# EAGLE design Temperature Module (EAGLE 9.1.3)
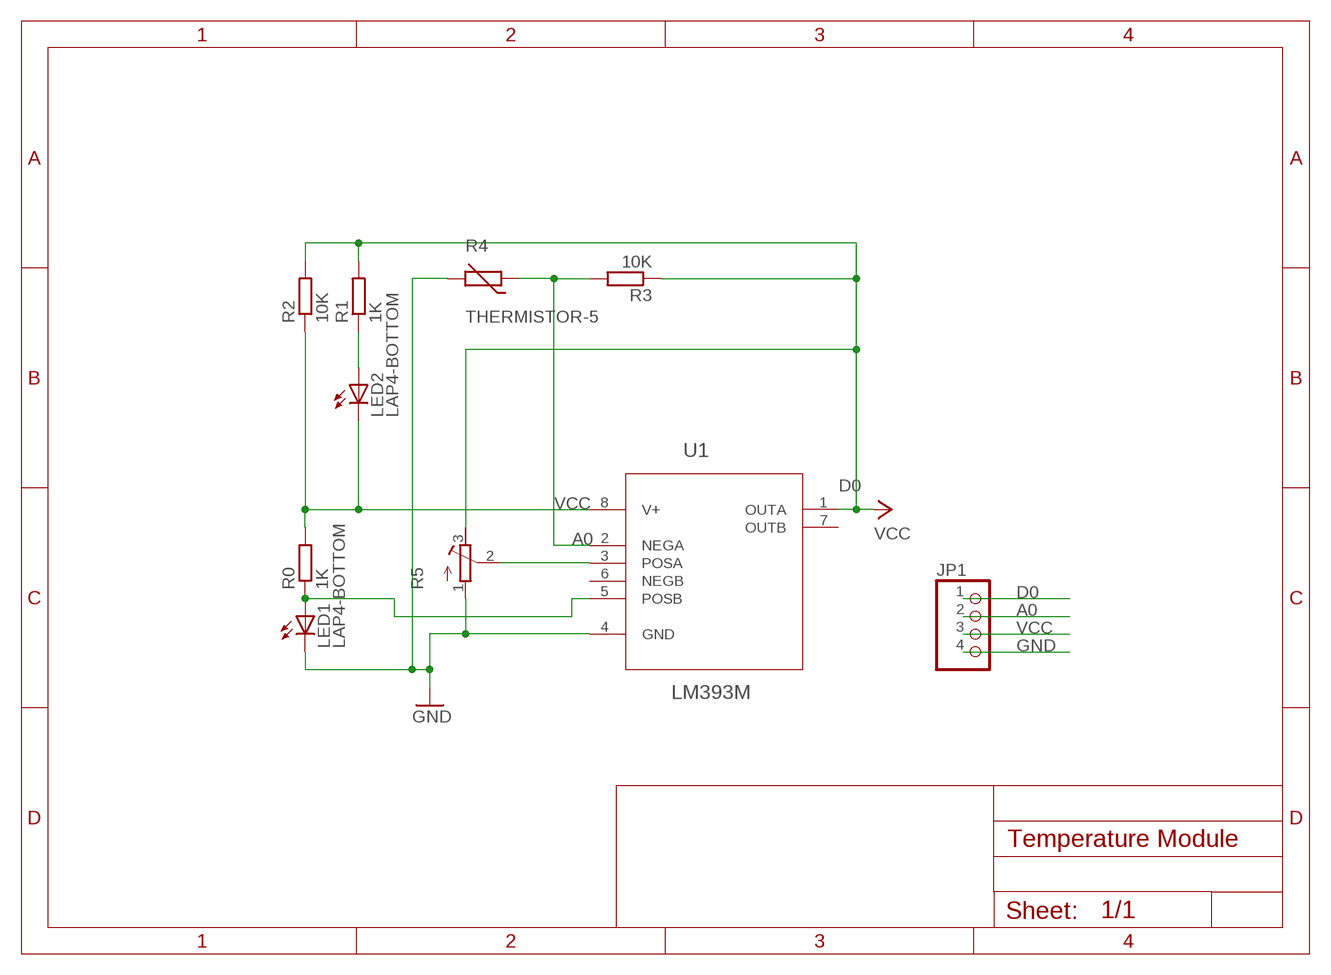
[diagram p0: schematic, sheet 1]

## Parts
JP1  PINHD-1X4  [1X04]
LED1  LAP4-BOTTOM  [P47F-BOTTOM]
LED2  LAP4-BOTTOM  [P47F-BOTTOM]
R0  1K  R-EU_MELF0207R  [MINI_MELF-0207R]
R1  1K  R-EU_MELF0207R  [MINI_MELF-0207R]
R2  10K  R-EU_MELF0207R  [MINI_MELF-0207R]
R3  10K  R-EU_MELF0207R  [MINI_MELF-0207R]
R4  THERMISTOR-5  [R-5]
R5  R-TRIMMCVR42A  [RTRIMCVR42A]
U1  LM393M  [SOIC127P620X175-8N]

## Nets
A0: JP1.2 R3.2 R4.1 U1.2(NEGA)
D0: JP1.1 R1.2 R2.2 R3.1 R5.3(E) U1.1(OUTA) ; supply symbol labelled VCC
GND: JP1.4 LED1.C R4.2 R5.1(A) U1.4(GND)
N$3: R5.2(S) U1.3(POSA)
N$5: LED1.A R0.1 U1.5(POSB)
N$6: LED2.A R1.1
VCC: JP1.3 LED2.C R0.2 R2.1 U1.8(V+)
Unconnected: U1.6(NEGB) U1.7(OUTB)

## Library data of the parts
JP1 = pinhead:PINHD-1X4: PIN HEADER
LED1 LED2 = led:*P4: PointLED® Enhanced Thinfilm LED TOP & BOTTOM mount LS P47F, LR P47F, LA P47F, LY P47F, LT P4SG, LB P4SG, LW P4SG Source: http://catalog.osram-os.com .. LA_LR_LS_LY_P47F_Pb_free.pdf
R0 R1-R3 = resistor:R-EU_: RESISTOR, European symbol
R4 = varistor:THERMISTOR: THERMISTOR
R5 = resistor:R-TRIMM: Trimm resistor
U1 = LM393M:LM393M: Low Power Low Offset Voltage Dual Comparators; AVAILABILITY: Good; DESCRIPTION: LM393 Series Very Low Supply Current Low Power Dual Voltage Comparator - SOP8; MF: Texas Instruments; MP: LM393M; PACKAGE: SOIC-8 ON Semiconductor; PRICE: 0.30 USD

## Board
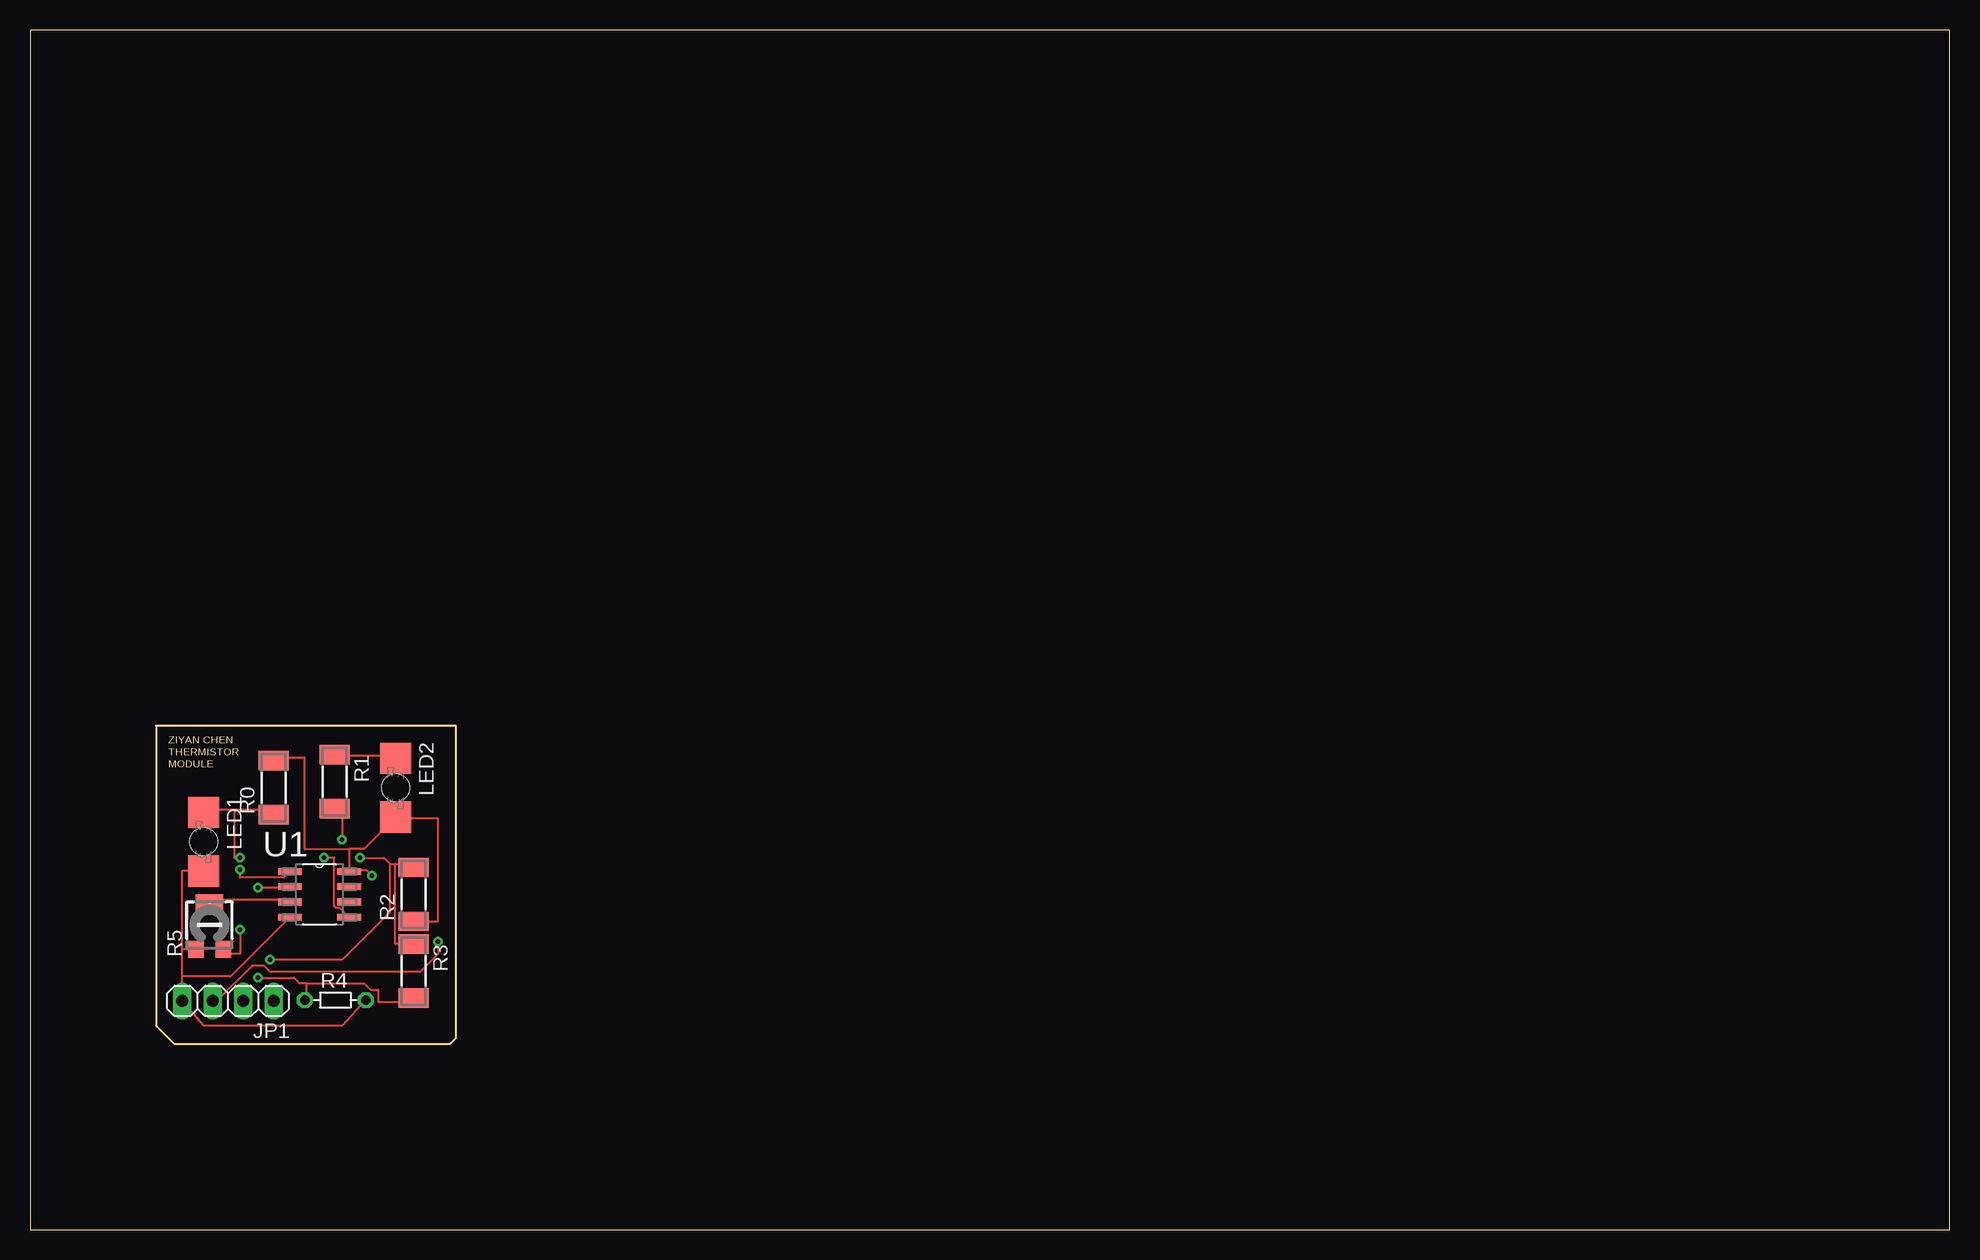
[diagram p1: board, top side]
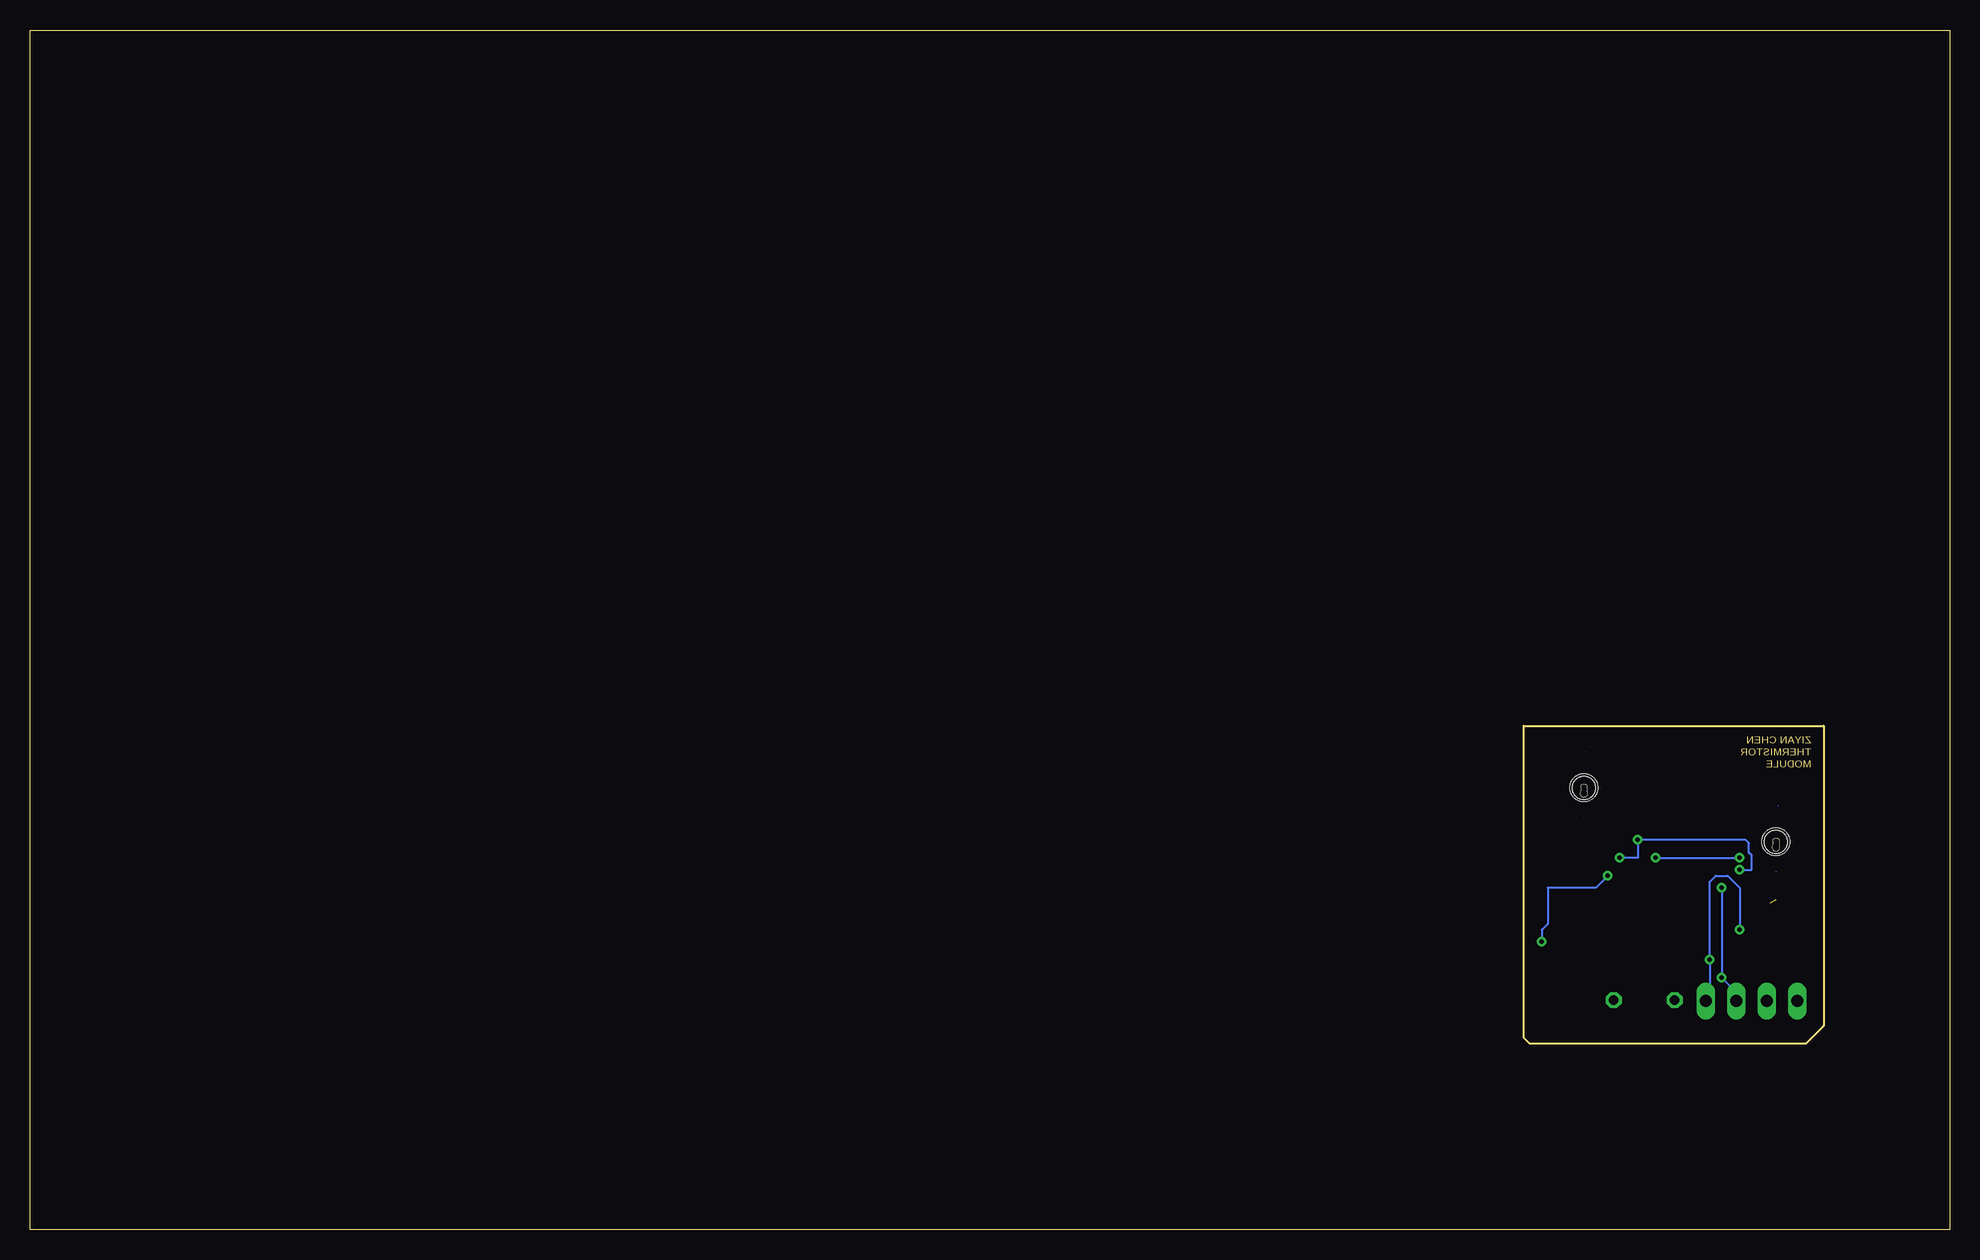
[diagram p2: board, bottom side, seen from below]

Size 160 x 100 mm. Coordinates in mm from the lower left corner, seen from the top.
Outline: 0,0 160,0 160,100 0,100 0,0
Outline: 35.5,42 10.5,42 10.5,17 12,15.5 35,15.5 35.5,16 35.5,42
Copper layers (1*16): Top 0.035mm / dielectric 1.5mm / Bottom 0.035mm
Design rules "default": minimum track width 6mil, minimum drill 0.35mm, track to track 6mil, track to pad 6mil, pad to pad 6mil, via to via 6mil, smd to smd 6mil, copper to edge 40mil, drill to drill 6mil, minimum pad ring 10mil, minimum via ring 8mil, stop-mask expansion 4mil, vias tented up to drill 0mil, thermal gap 10mil

### Footprints (pad centres in the part's own frame; a part is rotated, then mirrored left to right if it is on the bottom)
1X04 = drill 1.016 long: 1 -3.81,0; 2 -1.27,0; 3 1.27,0; 4 3.81,0
P47F-BOTTOM = smd 2.6 x 2.6: A -2.45,0; C 2.45,0 | hole 2.3: 0,0
MINI_MELF-0207R = smd 1.6 x 2.5: 1 -2.25,0; 2 2.25,0
R-5 = drill 0.813 octagon: 1 -2.54,0; 2 2.54,0
RTRIMCVR42A = smd 1.3 x 1.4: 1 -1.15,-2.05; 3 1.15,-2.05 | smd 2.3 x 1.5: 2 0,1.8
SOIC127P620X175-8N = smd 1.981 x 0.559: 1 -2.464,1.905; 2 -2.464,0.635; 3 -2.464,-0.635; 4 -2.464,-1.905; 5 2.464,-1.905; 6 2.464,-0.635; 7 2.464,0.635; 8 2.464,1.905

### Placement (x,y rotation side)
JP1  16.51,19.05 180 top
LED1  14.47,32.33 270 top
LED2  30.48,36.83 270 top
R0  20.32,36.83 90 top
R1  25.4,37.33 270 top
R2  31.98,27.94 90 top
R3  31.98,21.55 270 top
R4  25.45,19.13 0 top
R5  14.97,25.4 0 top
U1  24.13,27.94 0 top

### Tracks (layer width: path | path; a pad name or v marks a point on that pad's centre or on a via)
A0  (via drill 0.35)
  Top 0.152: 23,20.52 22.48,20.52 22,21 v19,21 | U1.2 21,28.5 v19,28.5 | R3.2 31,19 29,19 29,20 28.38,20 27.86,20.52 23,20.52 | R4.1 23,19.5 23,20 23,20.02 23,20.52
  Bottom 0.152: v19,28.5 v19,21 17.78,19.78 JP1.2
D0  (via drill 0.35)  (1 unrouted)
  Top 0.152: R3.1 30.44,23.8 30.44,30.48 | 30.44,30.48 31.69,30.48 R2.2 | R1.2 25.92,35.08 26,35 v26,32.5 | v20,22.5 26,22.5 30,26.5 30,30.48 30.44,30.48 | v17.5,30 17.5,29.34 21.17,29.34 U1.1 | v17.5,25 17.5,23 16.47,23 R5.3 | v27.5,31 29.5,31 30,30.5
  Bottom 0.152: JP1.1 20,19.37 v20,22.5 20,29 19.5,29.5 18.5,29.5 17.5,28.5 v17.5,25 | v17.5,30 16.5,30 16.5,31.19 16.71,31.4 16.71,32.21 17,32.5 v26,32.5 26,31 v27.5,31
GND
  Top 0.152: LED1.C 12.66,29.88 12.66,23.36 | 12.66,23.36 12.66,21.59 12.66,21.09 | U1.4 16.72,21.09 12.66,21.09 | 12.66,23.36 R5.1 | R4.2 26,17 14.5,17 JP1.4 12.66,19.05 12.66,21.09
N$3  (1 unrouted)
  Top 0.152: U1.3 21,27.5 14.5,27.5
N$5  (via drill 0.35)
  Top 0.152: U1.5 25.83,26.8 25.51,26.8 25.38,26.93 25.38,31 v24.5,31 | 17,35 19.5,35 R0.1 | v17.5,31 17,31 17,35 | 17,35 15.5,35 LED1.A
  Bottom 0.152: v24.5,31 v17.5,31
N$6
  Top 0.152: LED2.A 30.22,39.28 30,39.5 25.48,39.5 R1.1
VCC  (via drill 0.35)
  Top 0.152: R2.1 34.02,25.69 34.02,34.29 30.57,34.29 LED2.C 27.85,31.75 26.67,31.75 | 26.67,31.75 26.59,31.67 U1.8 27.34,29.84 27.5,30 28,30 v28.5,29.5 | R0.2 20.61,39.37 22.86,39.37 22.86,31.75 26.67,31.75 | v34,24 34,23 32.5,21.5 20,21.5 19.5,22 18.5,22 15.55,19.05 JP1.3
  Bottom 0.152: v28.5,29.5 29.5,28.5 33.5,28.5 33.5,25.5 34,25 v34,24

### Text on the board
Dimension: THERMISTOR | ZIYAN CHEN | MODULE